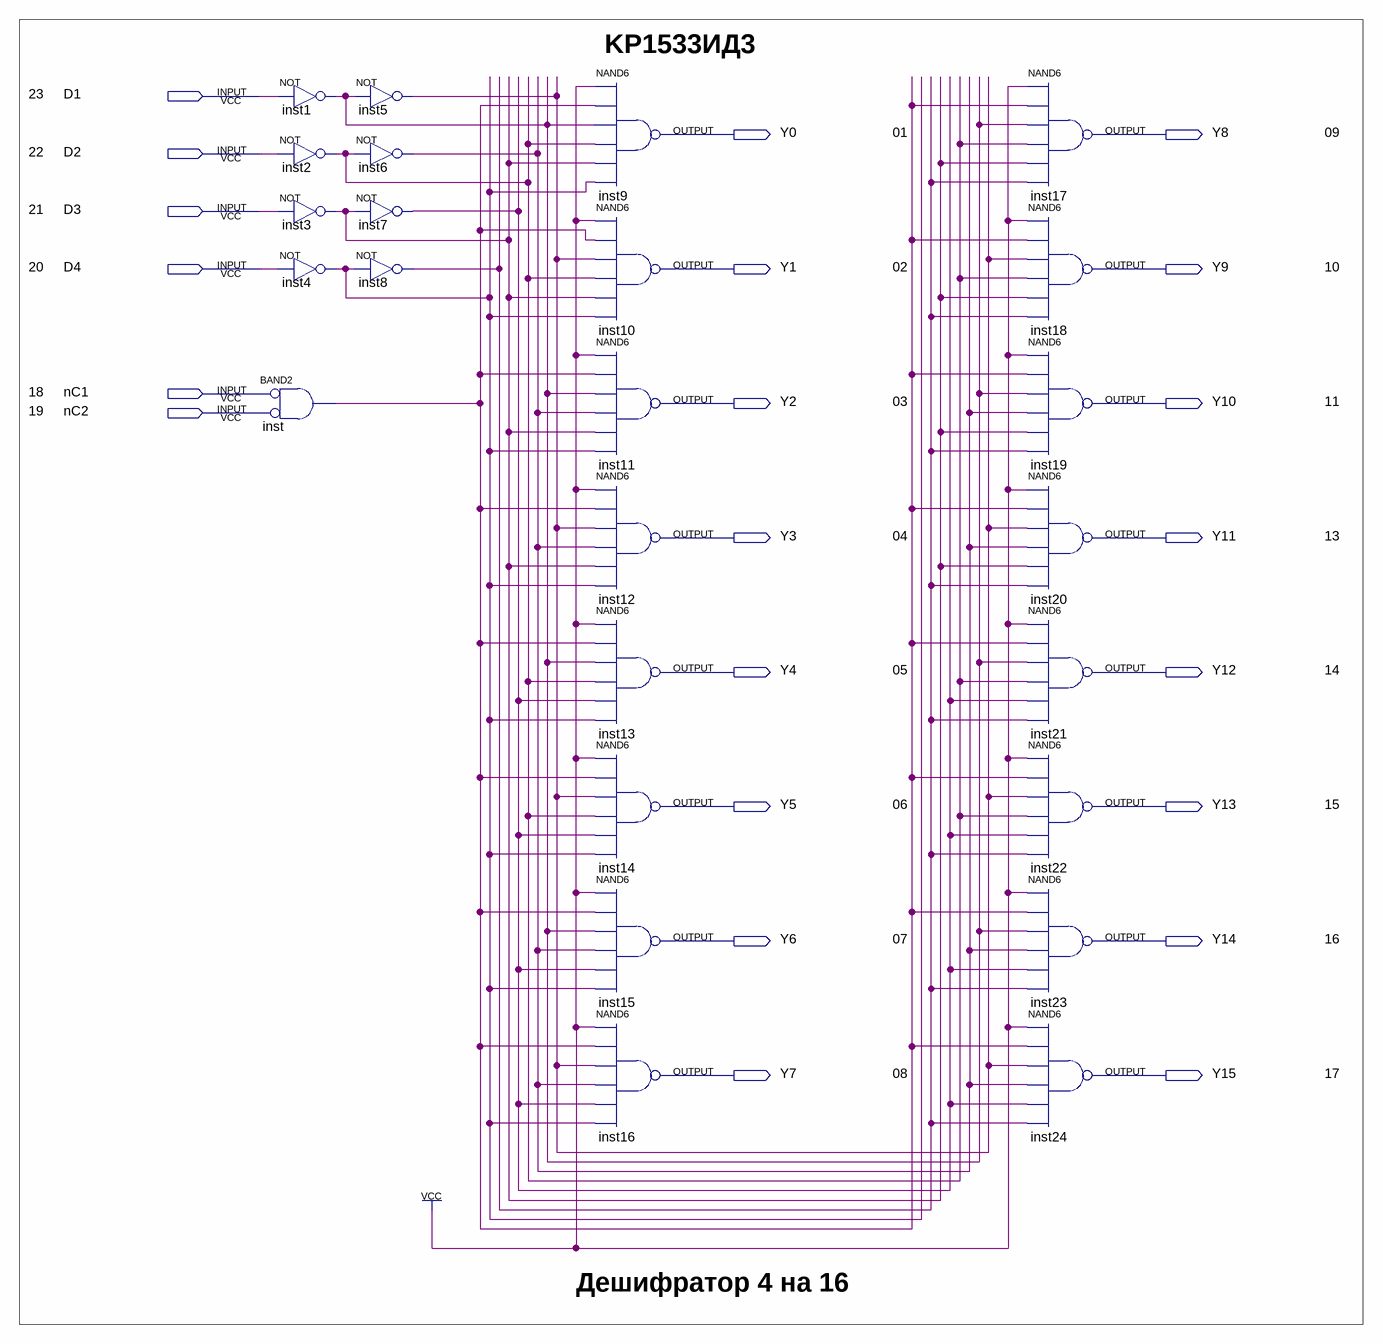
[diagram p0: schematic sheet]
// Quartus schematic KP1533ID3.bdf as structural Verilog: 25 symbols, 22 pins
module KP1533ID3 (
  input  D1,
  input  D2,
  input  D3,
  input  D4,
  input  nC1,
  input  nC2,
  output Y0,
  output Y8,
  output Y1,
  output Y9,
  output Y2,
  output Y10,
  output Y3,
  output Y11,
  output Y4,
  output Y12,
  output Y5,
  output Y13,
  output Y6,
  output Y14,
  output Y7,
  output Y15
);

  wire inst1_out, inst2_out, inst3_out, inst4_out, inst5_out, inst6_out, inst7_out, inst8_out, inst_out;

  not inst1 (inst1_out, D1);
  not inst2 (inst2_out, D2);
  not inst3 (inst3_out, D3);
  not inst4 (inst4_out, D4);
  and inst (inst_out, ~nC1, ~nC2);  // BAND2
  not inst5 (inst5_out, inst1_out);
  not inst6 (inst6_out, inst2_out);
  not inst7 (inst7_out, inst3_out);
  not inst8 (inst8_out, inst4_out);
  nand inst9 (Y0, 1'b1, inst_out, inst1_out, inst2_out, inst3_out, inst4_out);
  nand inst10 (Y1, 1'b1, inst_out, inst5_out, inst2_out, inst3_out, inst4_out);
  nand inst11 (Y2, 1'b1, inst_out, inst1_out, inst6_out, inst3_out, inst4_out);
  nand inst12 (Y3, 1'b1, inst_out, inst5_out, inst6_out, inst3_out, inst4_out);
  nand inst13 (Y4, 1'b1, inst_out, inst1_out, inst2_out, inst7_out, inst4_out);
  nand inst14 (Y5, 1'b1, inst_out, inst5_out, inst2_out, inst7_out, inst4_out);
  nand inst15 (Y6, 1'b1, inst_out, inst1_out, inst6_out, inst7_out, inst4_out);
  nand inst16 (Y7, 1'b1, inst_out, inst5_out, inst6_out, inst7_out, inst4_out);
  nand inst17 (Y8, 1'b1, inst_out, inst1_out, inst2_out, inst3_out, inst8_out);
  nand inst18 (Y9, 1'b1, inst_out, inst5_out, inst2_out, inst3_out, inst8_out);
  nand inst19 (Y10, 1'b1, inst_out, inst1_out, inst6_out, inst3_out, inst8_out);
  nand inst20 (Y11, 1'b1, inst_out, inst5_out, inst6_out, inst3_out, inst8_out);
  nand inst21 (Y12, 1'b1, inst_out, inst1_out, inst2_out, inst7_out, inst8_out);
  nand inst22 (Y13, 1'b1, inst_out, inst5_out, inst2_out, inst7_out, inst8_out);
  nand inst23 (Y14, 1'b1, inst_out, inst1_out, inst6_out, inst7_out, inst8_out);
  nand inst24 (Y15, 1'b1, inst_out, inst5_out, inst6_out, inst7_out, inst8_out);

  // Notes on the sheet:
  //   KP1533ИД3
  //   23
  //   01
  //   09
  //   22
  //   21
  //   20
  //   02
  //   10
  //   18
  //   03
  //   11
  //   19
  //   04
  //   13
  //   05
  //   14
  //   06
  //   15
  //   07
  //   16
  //   08
  //   17
  //   Дешифратор 4 на 16
endmodule
